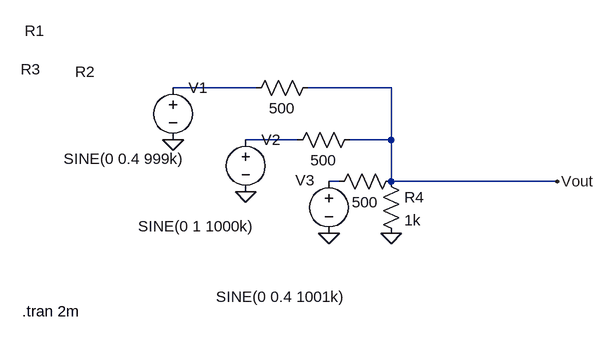
[diagram p0: schematic Εργαστήριο10επιπλέον2.asc]
Εργαστήριο10επιπλέον2.asc, the LTspice schematic file:
Version 4
SHEET 1 880 680
WIRE 176 64 48 64
WIRE 384 64 256 64
WIRE 240 144 160 144
WIRE 384 144 384 64
WIRE 384 144 320 144
WIRE 304 208 288 208
WIRE 384 208 384 144
WIRE 640 208 384 208
FLAG 48 144 0
FLAG 160 224 0
FLAG 288 288 0
FLAG 384 288 0
FLAG 640 208 Vout
SYMBOL voltage 48 48 R0
WINDOW 3 -168 125 Left 2
WINDOW 123 0 0 Left 0
WINDOW 39 0 0 Left 0
SYMATTR InstName V1
SYMATTR Value SINE(0 0.4 999k)
SYMBOL voltage 160 128 R0
WINDOW 3 -166 149 Left 2
WINDOW 123 0 0 Left 0
WINDOW 39 0 0 Left 0
SYMATTR InstName V2
SYMATTR Value SINE(0 1 1000k)
SYMBOL voltage 288 192 R0
WINDOW 0 -51 14 Left 2
WINDOW 3 -174 193 Left 2
WINDOW 123 0 0 Left 0
WINDOW 39 0 0 Left 0
SYMATTR InstName V3
SYMATTR Value SINE(0 0.4 1001k)
SYMBOL res 272 48 R90
WINDOW 0 -56 437 VBottom 2
WINDOW 3 32 56 VTop 2
SYMATTR InstName R1
SYMATTR Value 500
SYMBOL res 336 128 R90
WINDOW 0 -73 423 VBottom 2
WINDOW 3 32 56 VTop 2
SYMATTR InstName R2
SYMATTR Value 500
SYMBOL res 400 192 R90
WINDOW 0 -141 571 VBottom 2
WINDOW 3 32 56 VTop 2
SYMATTR InstName R3
SYMATTR Value 500
SYMBOL res 368 192 R0
SYMATTR InstName R4
SYMATTR Value 1k
TEXT -184 408 Left 2 !.tran 2m

The netlist it stands for:
* Εργαστήριο10επιπλέον2.asc
V1 N001 0 SINE(0 0.4 999k)
V2 N002 0 SINE(0 1 1000k)
V3 N003 0 SINE(0 0.4 1001k)
R1 Vout N001 500
R2 Vout N002 500
R3 Vout N003 500
R4 Vout 0 1k
.tran 2m
.backanno
.end